# Altium schematic sheet prosthesis.SchDoc
size 558 x 431 mm; SheetNumber: 1; SheetTotal: 1; ENG_APP_DATE: --/--/--; DSN_APP_DATE: --/--/--; CHK_APP_DATE: --/--/--
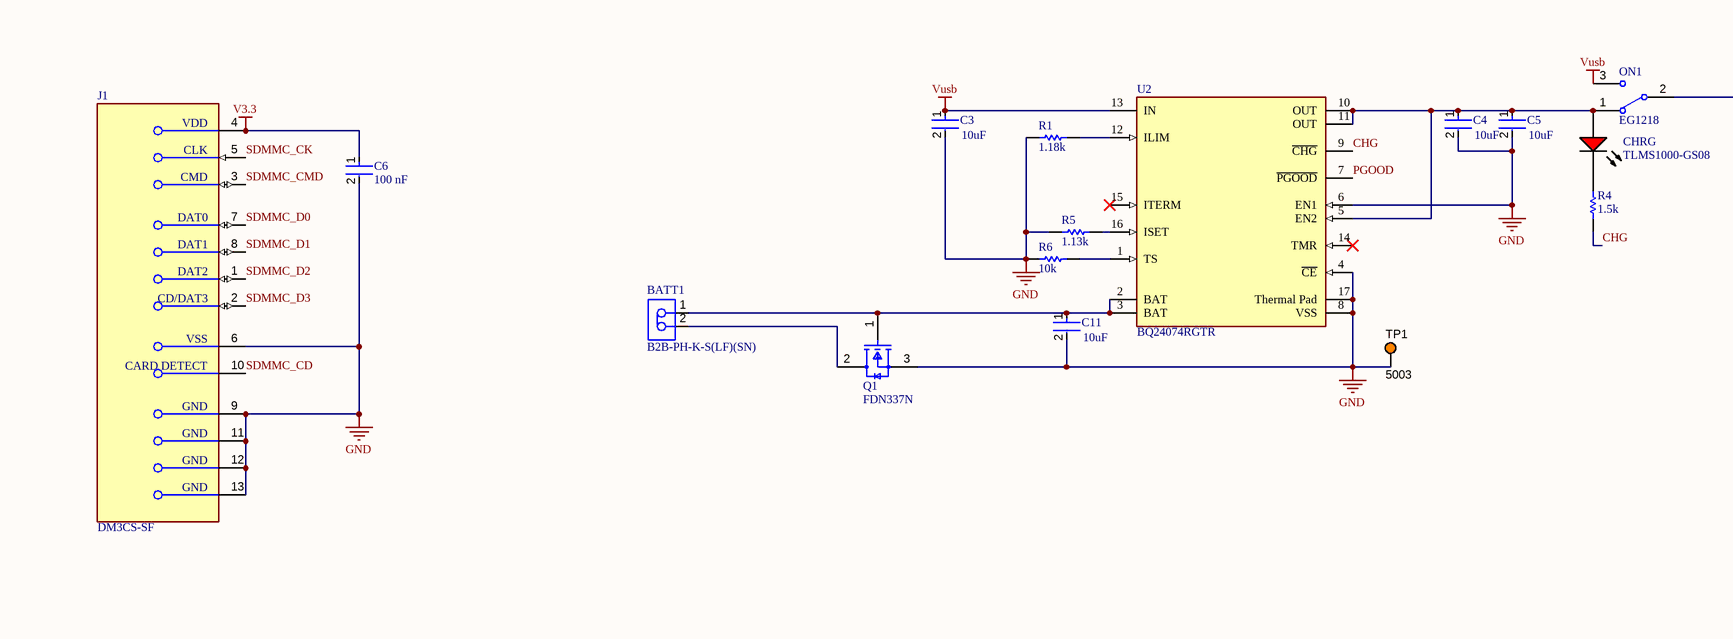
[diagram p0: prosthesis.SchDoc, top left]
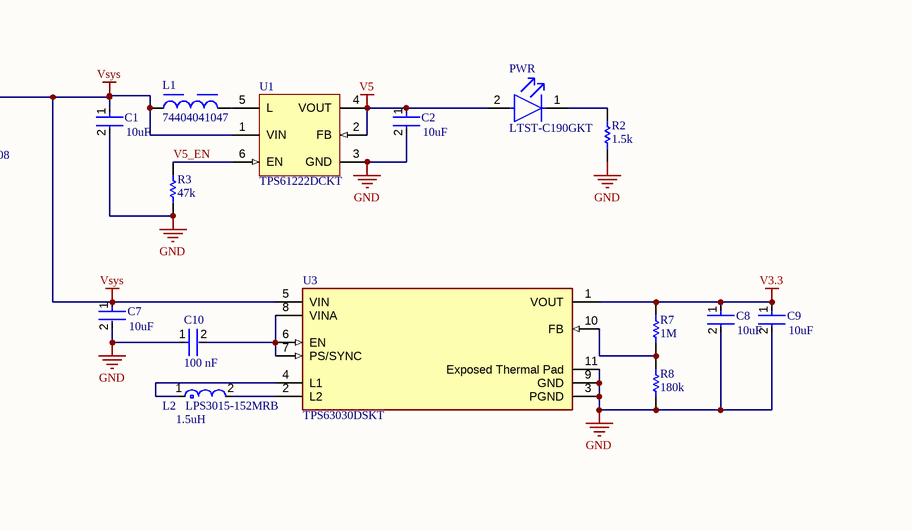
[diagram p1: prosthesis.SchDoc, top right]
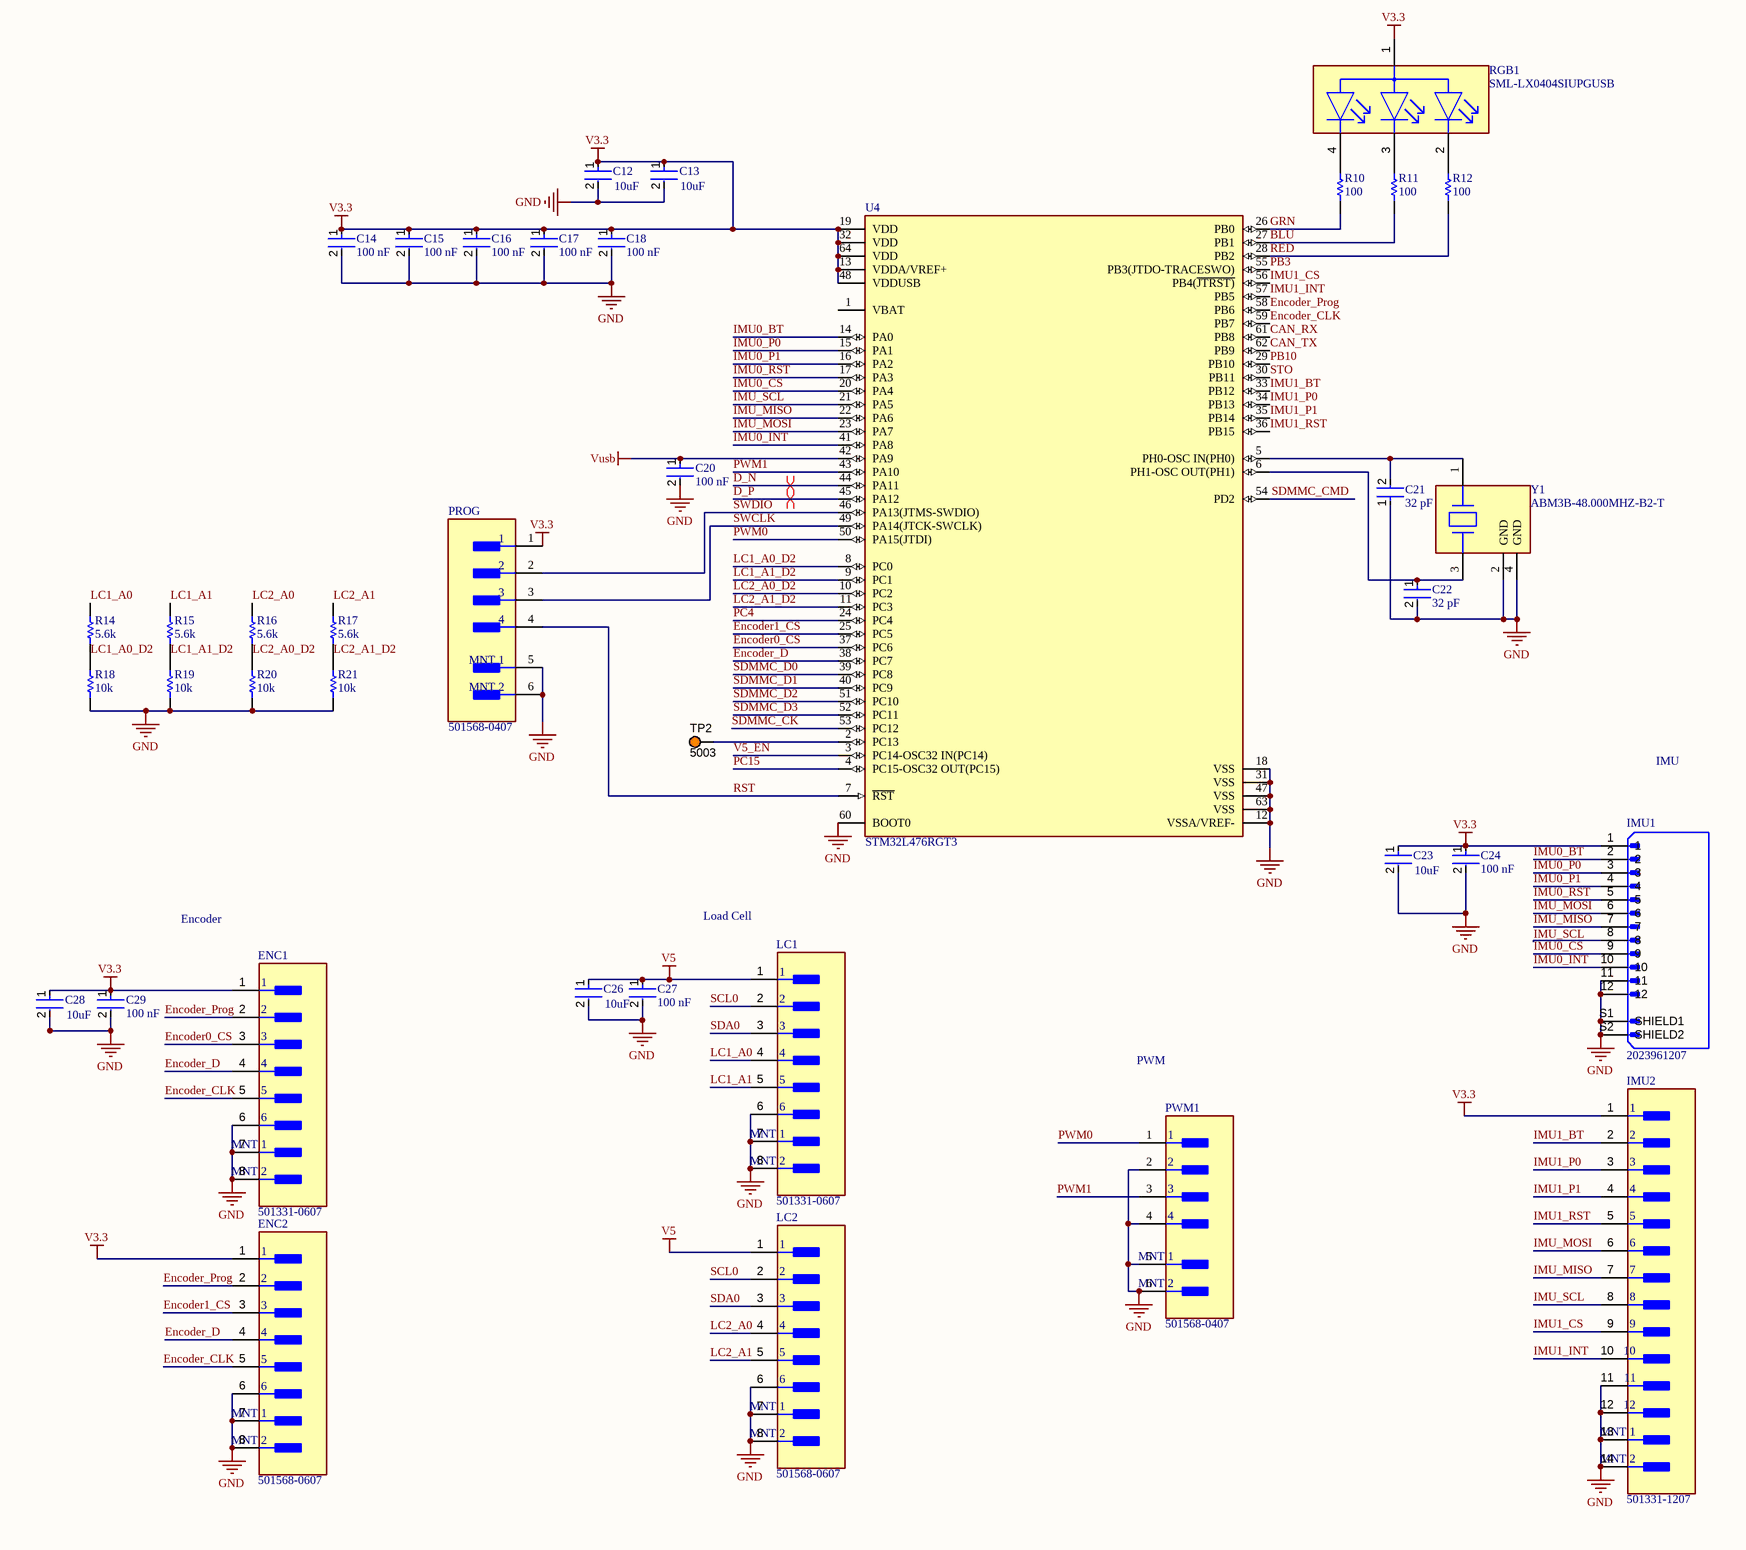
[diagram p2: prosthesis.SchDoc, bottom left]
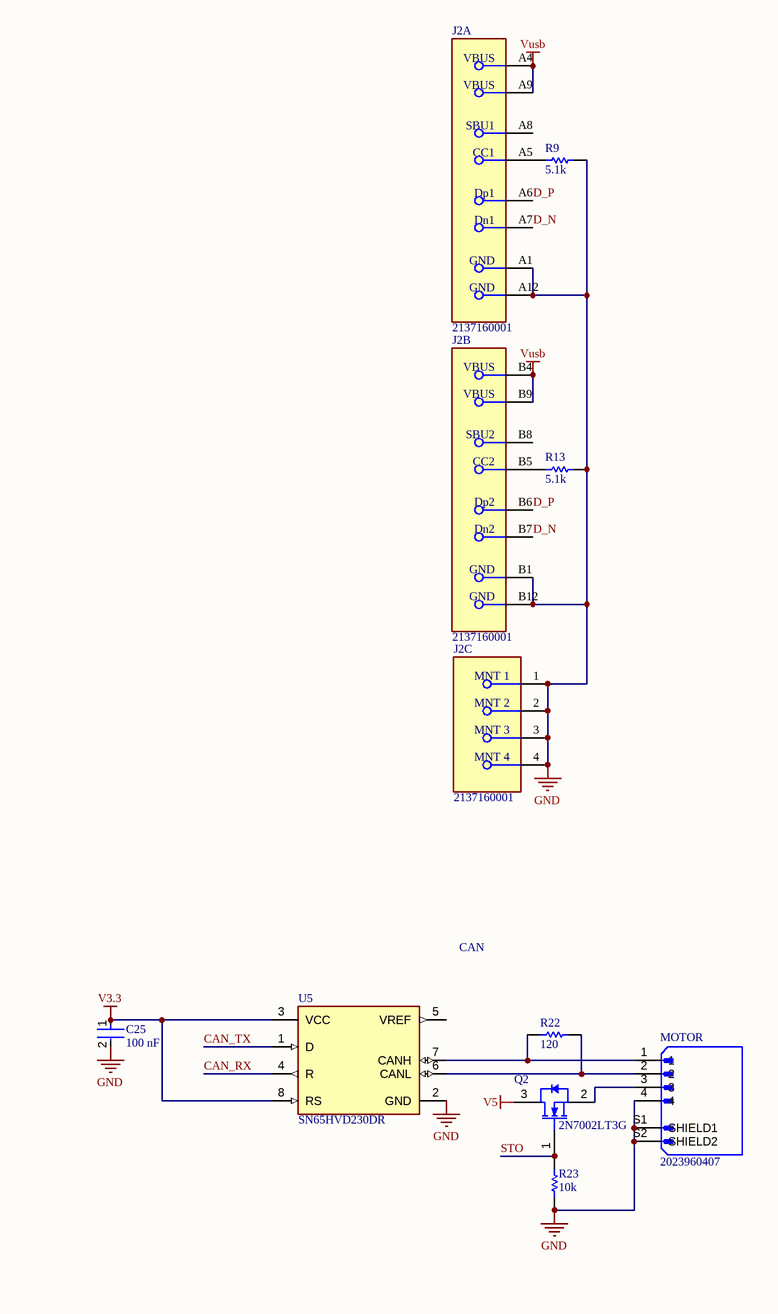
[diagram p3: prosthesis.SchDoc, bottom right]

## Parts
BATT1  B2B-PH-K-S(LF)(SN)  [JST-B2B-PH-K-S_V]
C1  Capacitance: 10uF  [FP-GRM21B-0_1-IPC_C]  (hidden comment: GRM21BR61C106KE15L)
C2  Capacitance: 10uF  [FP-GRM21B-0_1-IPC_C]  (hidden comment: GRM21BR61C106KE15L)
C3  Capacitance: 10uF  [FP-GRM21B-0_1-IPC_C]  (hidden comment: GRM21BR61C106KE15L)
C4  Capacitance: 10uF  [FP-GRM21B-0_1-IPC_C]  (hidden comment: GRM21BR61C106KE15L)
C5  Capacitance: 10uF  [FP-GRM21B-0_1-IPC_C]  (hidden comment: GRM21BR61C106KE15L)
C6  value 100 nF  [FP-CC0805-0_85-MFG]  (hidden comment: CC0805KRX7R7BB104)
C7  Capacitance: 10uF  [FP-GRM21B-0_1-IPC_C]  (hidden comment: GRM21BR61C106KE15L)
C8  Capacitance: 10uF  [FP-GRM21B-0_1-IPC_C]  (hidden comment: GRM21BR61C106KE15L)
C9  Capacitance: 10uF  [FP-GRM21B-0_1-IPC_C]  (hidden comment: GRM21BR61C106KE15L)
C10  value 100 nF  [FP-CC0805-0_85-MFG]  (hidden comment: CC0805KRX7R7BB104)
C11  Capacitance: 10uF  [FP-GRM21B-0_1-IPC_C]  (hidden comment: GRM21BR61C106KE15L)
C12  Capacitance: 10uF  [FP-GRM21B-0_1-IPC_C]  (hidden comment: GRM21BR61C106KE15L)
C13  Capacitance: 10uF  [FP-GRM21B-0_1-IPC_C]  (hidden comment: GRM21BR61C106KE15L)
C14  value 100 nF  [FP-CC0805-0_85-MFG]  (hidden comment: CC0805KRX7R7BB104)
C15  value 100 nF  [FP-CC0805-0_85-MFG]  (hidden comment: CC0805KRX7R7BB104)
C16  value 100 nF  [FP-CC0805-0_85-MFG]  (hidden comment: CC0805KRX7R7BB104)
C17  value 100 nF  [FP-CC0805-0_85-MFG]  (hidden comment: CC0805KRX7R7BB104)
C18  value 100 nF  [FP-CC0805-0_85-MFG]  (hidden comment: CC0805KRX7R7BB104)
C20  value 100 nF  [FP-CC0805-0_85-MFG]  (hidden comment: CC0805KRX7R7BB104)
C21  value 32 pF  [FP-CC0805-0_85-MFG]  (hidden comment: 32pF)
C22  value 32 pF  [FP-CC0805-0_85-MFG]  (hidden comment: 32pF)
C23  Capacitance: 10uF  [FP-GRM21B-0_1-IPC_C]  (hidden comment: GRM21BR61C106KE15L)
C24  value 100 nF  [FP-CC0805-0_85-MFG]  (hidden comment: CC0805KRX7R7BB104)
C25  value 100 nF  [FP-CC0805-0_85-MFG]  (hidden comment: CC0805KRX7R7BB104)
C26  Capacitance: 10uF  [FP-GRM21B-0_1-IPC_C]  (hidden comment: GRM21BR61C106KE15L)
C27  value 100 nF  [FP-CC0805-0_85-MFG]  (hidden comment: CC0805KRX7R7BB104)
C28  Capacitance: 10uF  [FP-GRM21B-0_1-IPC_C]  (hidden comment: GRM21BR61C106KE15L)
C29  value 100 nF  [FP-CC0805-0_85-MFG]  (hidden comment: CC0805KRX7R7BB104)
CHRG  TLMS1000-GS08  [VISH-TLMS1000_V]
ENC1  501331-0607  [FP-501331-0607-MFG]
ENC2  501568-0607  [FP-501568-0607-MFG]
IMU1  2023961207  [MOLEX_2023961207]
IMU2  501331-1207  [FP-501331-1207-MFG]
J1  DM3CS-SF  [FP-DM3CS-SF-MFG]
J2  2137160001  [FP-2137160001-MFG]  (parts A,B,C of 3)
L1  74404041047  [WE-LQS_4012]
L2  LPS3015-152MRB  Inductance: 1.5uH  [FP-LPS3015-MFG]
LC1  501331-0607  [FP-501331-0607-MFG]
LC2  501568-0607  [FP-501568-0607-MFG]
MOTOR  2023960407  [MOLEX_2023960407]
ON1  EG1218  [ESWI-EG1218_V]
PROG  501568-0407  [FP-501568-0407-MFG]
PWM1  501568-0407  [FP-501568-0407-MFG]
PWR  LTST-C190GKT  [FP-LTST-C190GKT-MFG]
Q1  FDN337N  [FP-527AG-MFG]
Q2  2N7002LT3G  [ONSC-SOT-23-3-318-08_V]
R1  1.18k  [RESC2013X70X40ML20T20]
R2  1.5k  [RESC2013X70X40NL20T20]
R3  47k  [RESC2013X70X40ML20T20]
R4  1.5k  [RESC2013X70X40NL20T20]
R5  1.13k  [RESC2013X60X35NL10T20]
R6  10k  [RESC2013X60X35NL10T20]
R7  1M  [RESC1608X55X30NL15T15]
R8  180k  [RESC2013X50X40NL20T20]
R9  5.1k  [RESC2013X60X40LL20T25]
R10  100  [RESC2013X60X40ML20T25]
R11  100  [RESC2013X60X40ML20T25]
R12  100  [RESC2013X60X40ML20T25]
R13  5.1k  [RESC2013X60X40LL20T25]
R14  5.6k  [RESC2013X70X40LL20T20]
R15  5.6k  [RESC2013X70X40LL20T20]
R16  5.6k  [RESC2013X70X40LL20T20]
R17  5.6k  [RESC2013X70X40LL20T20]
R18  10k  [RESC2013X70X40LL20T20]
R19  10k  [RESC2013X70X40LL20T20]
R20  10k  [RESC2013X70X40LL20T20]
R21  10k  [RESC2013X70X40LL20T20]
R22  120  [RESC2013X60X40ML20T25]
R23  10k  [RESC2013X70X40LL20T20]
RGB1  SML-LX0404SIUPGUSB  [FP-SML-LX0404SIUPGUSB-MFG]
TP1  5003  [KSTN-5003]
TP2  5003  [KSTN-5003]
U1  TPS61222DCKT  [DCK0006A_N]
U2  BQ24074RGTR  [FP-RGT0016C-IPC_B]
U3  TPS63030DSKT  [FP-DSK0010A-IPC_B]
U4  STM32L476RGT3  [FP-LQFP64-5W-IPC_C]
U5  SN65HVD230DR  [FP-D0008A-IPC_A]
Y1  ABM3B-48.000MHZ-B2-T  [FP-ABM3B-MFG]

## Nets
GND: C1.2 C2.2 C3.2 C4.2 C5.2 C6.2 C7.2 C8.2 C9.2 C10.1 C11.2 C12.2 C13.2 C14.2 C15.2 C16.2 C17.2 C18.2 C20.2 C21.1 C22.2 C23.2 C24.2 C25.2 C26.2 C27.2 C28.2 C29.2 ENC1.6 ENC1.7(MNT_1) ENC1.8(MNT_2) ENC2.6 ENC2.7(MNT_1) ENC2.8(MNT_2) IMU1.11 IMU1.12 IMU1.S1(SHIELD1) IMU1.S2(SHIELD2) IMU2.11 IMU2.12 IMU2.13(MNT_1) IMU2.14(MNT_2) J1.6(VSS) J1.9(GND) J1.11(GND) J1.12(GND) J1.13(GND) J2.1(MNT_1) J2.2(MNT_2) J2.3(MNT_3) J2.4(MNT_4) J2.A1(GND) J2.A12(GND) J2.B1(GND) J2.B12(GND) LC1.6 LC1.7(MNT_1) LC1.8(MNT_2) LC2.6 LC2.7(MNT_1) LC2.8(MNT_2) MOTOR.4 MOTOR.S1(SHIELD1) MOTOR.S2(SHIELD2) PROG.5(MNT_1) PROG.6(MNT_2) PWM1.2 PWM1.4 PWM1.5(MNT_1) PWM1.6(MNT_2) Q1.3(S) R1.2 R2.1 R3.1 R5.1 R6.1 R8.1 R9.2 R13.2 R18.1 R19.1 R20.1 R21.1 R23.1 TP1.1 U1.3(GND) U2.4(~{CE}) U2.6(EN1) U2.8(VSS) U2.17(Thermal_Pad) U3.3(PGND) U3.9(GND) U3.11(Exposed_Thermal_Pad) U4.12(VSSA/VREF-) U4.18(VSS) U4.31(VSS) U4.47(VSS) U4.60(BOOT0) U4.63(VSS) U5.2(GND) Y1.2(GND) Y1.4(GND)
V3.3: C6.1 C8.1 C9.1 C12.1 C13.1 C14.1 C15.1 C16.1 C17.1 C18.1 C23.1 C24.1 C25.1 C28.1 C29.1 ENC1.1 ENC2.1 IMU1.1 IMU2.1 J1.4(VDD) PROG.1 R7.2 RGB1.1(Common_Anode) U3.1(VOUT) U4.13(VDDA/VREF+) U4.19(VDD) U4.32(VDD) U4.48(VDDUSB) U4.64(VDD) U5.3(VCC) U5.8(RS)
V5: C2.1 C26.1 C27.1 LC1.1 LC2.1 PWR.2(A) Q2.3(D) U1.2(FB) U1.4(VOUT)
Vsys: C1.1 C7.1 L1.1 ON1.2(COM) U1.1(VIN) U3.5(VIN)
Vusb: C3.1 C20.1 J2.A4(VBUS) J2.A9(VBUS) J2.B4(VBUS) J2.B9(VBUS) ON1.3 U2.13(IN) U4.42(PA9)
BLU: R11.1 U4.27(PB1)
CAN_RX: U4.61(PB8) U5.4(R)
CAN_TX: U4.62(PB9) U5.1(D)
CHG: R4.1 U2.9(~{CHG})
D_N: J2.A7(Dn1) J2.B7(Dn2) U4.44(PA11)
D_P: J2.A6(Dp1) J2.B6(Dp2) U4.45(PA12)
Encoder0_CS: ENC1.3 U4.37(PC6)
Encoder1_CS: ENC2.3 U4.25(PC5)
Encoder_CLK: ENC1.5 ENC2.5 U4.59(PB7)
Encoder_D: ENC1.4 ENC2.4 U4.38(PC7)
Encoder_Prog: ENC1.2 ENC2.2 U4.58(PB6)
GRN: R10.1 U4.26(PB0)
IMU0_BT: IMU1.2 U4.14(PA0)
IMU0_CS: IMU1.9 U4.20(PA4)
IMU0_INT: IMU1.10 U4.41(PA8)
IMU0_P0: IMU1.3 U4.15(PA1)
IMU0_P1: IMU1.4 U4.16(PA2)
IMU0_RST: IMU1.5 U4.17(PA3)
IMU1_BT: IMU2.2 U4.33(PB12)
IMU1_CS: IMU2.9 U4.56(PB4(~{JTRST)})
IMU1_INT: IMU2.10 U4.57(PB5)
IMU1_P0: IMU2.3 U4.34(PB13)
IMU1_P1: IMU2.4 U4.35(PB14)
IMU1_RST: IMU2.5 U4.36(PB15)
IMU_MISO: IMU1.7 IMU2.7 U4.22(PA6)
IMU_MOSI: IMU1.6 IMU2.6 U4.23(PA7)
IMU_SCL: IMU1.8 IMU2.8 U4.21(PA5)
LC1_A0: LC1.4 R14.2
LC1_A0_D2: R14.1 R18.2 U4.8(PC0)
LC1_A1: LC1.5 R15.2
LC1_A1_D2: R15.1 R19.2 U4.9(PC1)
LC2_A0: LC2.4 R16.2
LC2_A0_D2: R16.1 R20.2 U4.10(PC2)
LC2_A1: LC2.5 R17.2
LC2_A1_D2: R17.1 R21.2 U4.11(PC3)
PB3: U4.55(PB3(JTDO-TRACESWO))
PB10: U4.29(PB10)
PC4: U4.24(PC4)
PC15: U4.4(PC15-OSC32_OUT(PC15))
PGOOD: U2.7(~{PGOOD})
PWM0: PWM1.1 U4.50(PA15(JTDI))
PWM1: PWM1.3 U4.43(PA10)
RED: R12.1 U4.28(PB2)
RST: PROG.4 U4.7(~{RST})
SCL0: LC1.2 LC2.2
SDA0: LC1.3 LC2.3
SDMMC_CD: J1.10(CARD_DETECT)
SDMMC_CK: J1.5(CLK) U4.53(PC12)
SDMMC_CMD: J1.3(CMD) U4.54(PD2)
SDMMC_D0: J1.7(DAT0) U4.39(PC8)
SDMMC_D1: J1.8(DAT1) U4.40(PC9)
SDMMC_D2: J1.1(DAT2) U4.51(PC10)
SDMMC_D3: J1.2(CD/DAT3) U4.52(PC11)
STO: Q2.1(G) R23.2 U4.30(PB11)
SWCLK: PROG.3 U4.49(PA14(JTCK-SWCLK))
SWDIO: PROG.2 U4.46(PA13(JTMS-SWDIO))
V5_EN: R3.2 U1.6(EN) U4.3(PC14-OSC32_IN(PC14))
NetBATT1_1: BATT1.1 C11.1 Q1.1(G) U2.2(BAT) U2.3(BAT)
NetBATT1_2: BATT1.2 Q1.2(D)
NetC4_1: C4.1 C5.1 CHRG.1(A) ON1.1 U2.5(EN2) U2.10(OUT) U2.11(OUT)
NetC10_2: C10.2 U3.6(EN) U3.7(PS/SYNC) U3.8(VINA)
NetC21_2: C21.2 U4.5(PH0-OSC_IN(PH0)) Y1.1
NetC22_1: C22.1 U4.6(PH1-OSC_OUT(PH1)) Y1.3
NetCHRG_2: CHRG.2(K) R4.2
NetJ2_A5: J2.A5(CC1) R9.1
NetJ2_B5: J2.B5(CC2) R13.1
NetL1_2: L1.2 U1.5(L)
NetL2_1: L2.1 U3.4(L1)
NetL2_2: L2.2 U3.2(L2)
NetMOTOR_1: MOTOR.1 R22.1 U5.7(CANH)
NetMOTOR_2: MOTOR.2 R22.2 U5.6(CANL)
NetMOTOR_3: MOTOR.3 Q2.2(S)
NetPWR_1: PWR.1(C) R2.2
NetR1_1: R1.1 U2.12(ILIM)
NetR5_2: R5.2 U2.16(ISET)
NetR6_2: R6.2 U2.1(TS)
NetR7_1: R7.1 R8.2 U3.10(FB)
NetR10_2: R10.2 RGB1.4(Green_C)
NetR11_2: R11.2 RGB1.3(Blue_C)
NetR12_2: R12.2 RGB1.2(Red_C)
NetTP2_1: TP2.1 U4.2(PC13)

Not connected (* = marked no-connect by the designer): J2 A8(SBU1) B8(SBU2); U2 14(TMR)* 15(ITERM)*; U4 1(VBAT); U5 5(VREF)

## Layout directives
differential pair: D_N, D_P

## Notes on the sheet
- IMU
- CAN
- Encoder
- Load Cell
- PWM
- DWG. NO.
- REV.
- SHT.
- REVISION
- DESCRIPTION
- DATE
- APPROVED
- THIS DOCUMENT AND THE DATA DISCLOSED HEREIN OR HEREWITH IS THE PROPERTY OF ALTIUM LIMITED AND MAY BE FREELY DISTRIBUTED IN WHOLE. NO RIGHTS ARE RESERVED OR EXPRESS OR IMPLIED WARANTEE GIVEN.
- ENG:
- DSN:
- APPROVALS
- PROJECT
- DOCUMENT REVISION:
- DESIGN ITEM:
- CHK:
- BOM:
- REFERENCE DOCUMENTS
- PROJECT REVISION:
- TITLE
- FAB DWG:
- PCB DWG:
- ASSY DWG:
- SCALE:
- SIZE
- C
- CAGE CODE
- FILE NAME
- DWG NO.
- SHEET
- OF
- REV

## Library data of the parts
BATT1 = CMP-2000-05162-1: Male Header, Pitch 2 mm, 1 x 2 Position, Height 6 mm, Tail Length 3.4 mm, -25 to 85 degC, RoHS, Bulk; Manufacturer: JST; Pitch: 2mm; Style/Orientation: StraightHeader/Plug; No of Positions: 2; Datasheet Version: Nov-08; Datasheet URL: http://datasheet.octopart.com/B2B-PH-K-S%28LF%29%28SN%29-JST-datasheet-8324864.pdf; Manufacturer URL: http://www.jst.com/home2.html; Type: ShroudedHeader; Termination: Crimp
C1-C5 C7-C9 C11-C13 C23 C26 C28 = CMP-2007-03453-2: Chip Multilayer Ceramic Capacitors for General Purpose, 0805, 10uF, X5R, 15%, 10%, 16V; Radiation Hardening: No; Thickness: 0.053inch; Voltage Rating (DC): 16V; Lead Free: Lead Free; Package Quantity: 1; Width: 1.25mm; Case Code (Imperial): 0805; Depth: 1.25mm; Packaging: Tape and Reel; Dielectric: X5R; Max Operating Temperature: 85°C; Tolerance: 10%; Voltage Rating: 16V; Voltage: 16V; Height: 1.25mm; Case Code (Metric): 2012; Material: Ceramic; Mount: Surface Mount; Case/Package: 0805; REACH SVHC: No SVHC; Length: 2mm; Min Operating Temperature: -55°C; Termination: SMD/SMT
C6 C10 C14-C18 C20 C24 C25 C27 C29 = CMP-1036-04402-6: CAP CER 0.1UF 16V X7R 0805; Manufacturer: Yageo; Material: Ceramic; Tolerance: 0.1; Manufacturer Part Number: CC0805KRX7R7BB104; Temperature: -30°C to +85°C; Lead Free: Yes; Footprint Url: http://www.yageo.com/exep/pages/download/literatures/UPY-C_GEN_24.pdf; Voltage Rating: 16 V; Package: CC0805-0.85; RoHS: TRUE; Digikey Description: CAP CER 0.1UF 16V X7R 0805; Category: Cap; Octopart: https://octopart.com/cc0805krx7r7bb104-yageo-39467769; Capacitance: 100 nF; Device Class L3: Ceramic Capacitors; ComponentLink2URL: http://www.yageo.com/documents/recent/UPY-GPHC_Y5V_6.3V-to-50V_8.pdf; Temperature Range Low: -30°C; Mouser Description: Multilayer Ceramic Capacitors MLCC - SMD/SMT 100nF 16V X7R 10%; Automotive: No; Device Class L2: Capacitors; Height: 0.95mm; ComponentLink2Description: Datasheet; Temperature Characteristic: X7R; Ipc Land Pattern Name: CAPC200125X85; Device Class L1: Passive Components; Temperature Range High: +85°C
C21 C22 = CMP-1036-04402-6: CAP CER 32pF 16V X7R 0805; Manufacturer Part Number: CC0805KRX7R7BB104; Manufacturer: Yageo; Material: Ceramic; Tolerance: 0.1; Capacitance: 100 nF; Temperature: -30°C to +85°C; Lead Free: Yes; Footprint Url: http://www.yageo.com/exep/pages/download/literatures/UPY-C_GEN_24.pdf; Voltage Rating: 16 V; Package: CC0805-0.85; RoHS: TRUE; Digikey Description: CAP CER 0.1UF 16V X7R 0805; Category: Cap; Octopart: https://octopart.com/cc0805krx7r7bb104-yageo-39467769; Device Class L3: Ceramic Capacitors; ComponentLink2URL: http://www.yageo.com/documents/recent/UPY-GPHC_Y5V_6.3V-to-50V_8.pdf; Temperature Range Low: -30°C; Mouser Description: Multilayer Ceramic Capacitors MLCC - SMD/SMT 100nF 16V X7R 10%; Automotive: No; Device Class L2: Capacitors; Height: 0.95mm; ComponentLink2Description: Datasheet; Temperature Characteristic: X7R; Ipc Land Pattern Name: CAPC200125X85; Device Class L1: Passive Components; Temperature Range High: +85°C
CHRG = CMP-2000-07254-1: Low Current LED, 40 mW, 1.8 V, -40 to 100 degC, 2-Pin SMD (0603), RoHS, Tape and Reel; Manufacturer: Vishay; Lens Shape: Rectangular; Automotive Qualification Standard: AEC-Q100; Wavelength Typ: 636nm; SVHC: ToBeAdvised; LED Colour: Red; Bulb Size: 1.6mmx0.8mm; Forward Voltage: 1.8V; Luminous Intensity: 4mcd; Forward Current If: 2mA; Viewing Angle: 80°; Datasheet Version: Rev. 1.7, 02/2011; Datasheet URL: https://datasheet.ciiva.com/5798/1698881-5798337.pdf; LED Mounting: SMD; Packaging: CutTape; Package Reference: TLMS1000; Manufacturer URL: http://www.vishay.com/; Mounting Technology: SurfaceMount; Product Range: -; Package Description: 2-Pin Surface Mount Device, Body 1.6 x 0.8 mm; MSL: MSL2-1year
ENC1 LC1 = CMP-04776-000269-1: CONN HEADER SMD 6POS 1MM; Number of Positions: 6; Glow Wire Compliant: Non-compliant; Current Rating: 1A; Voltage Rating (AC): 50V; Gender: Male; Contact Resistance: 20mR; Connector Type: Male Pin; Max Voltage Rating (DC): 5.05kV; Color: Natural; Radiation Hardening: No; Housing Color: Natural; Max Operating Temperature: 85°C; Fastening Type: Detent; Min Operating Temperature: -40°C; Series: 501331; Orientation: Vertical; Number of Contacts: 6; Number of Circuits: 6; Contact Material: Bronze; Contact Gender: Male; Contact Plating: Tin; Lead Free: Lead Free; Number of Rows: 1; Max Voltage Rating (AC): 50V; Depth: 5.07mm; Pitch: 1mm; Packaging: Tape and Reel; Termination: Solder; RoHS Compliant: Yes; Mount: Surface Mount; Housing Material: Nylon; Voltage Rating: 50V; Contact Type: Male Pin; Package Quantity: 1100
ENC2 LC2 = CMP-04776-000027-1: CONN HEADER SMD R/A 6POS 1MM; Manufacturer: Molex; Conn Orientation: Right Angle; Conn Gender: Male; Current Rating: 1A; Number Of Contacts: 6; Voltage Rating: 50V; Standoff Height: 0.1mm; ComponentLink2Description: Datasheet; Device Class L3: unset; Temperature Range High: +105°C; Temperature Range Low: -40°C; Automotive: No; Mouser Description: Headers & Wire Housings 1.0 WtB 6Ckt R/AWaferAssyEmbsTpPk; Pitch: 1mm; Digikey Description: CONN HEADER SMD R/A 6POS 1MM; Height: 4.9mm; Category: Conn; Temperature: -40°C to +105°C; Footprint Url: https://www.molex.com/pdm_docs/sd/5015680607_sd.pdf; RoHS: TRUE; Number Of Rows: 1; Device Class L1: Connectors; Ambient Temperature Range High: +105°C; Lead Free: Yes; Device Class L2: Headers and Wire Housings; Manufacturer Part Number: 501568-0607; Octopart: https://octopart.com/501568-0607-molex-1389391; Package: 501568-0607; Ambient Temperature Range Low: -40°C; Contact Material: Tin,Nickel; ComponentLink2URL: https://www.molex.com/webdocs/datasheets/pdf/en-us/5015680607_PCB_HEADERS.pdf
IMU2 = CMP-04776-000917-1: CONN HEADER SMD 12POS 1MM; Number of Contacts: 12; Contact Resistance: 20mR; Current Rating: 1A; Voltage Rating: 50V; Glow Wire Compliant: Non-compliant; Max Voltage Rating (DC): 5.05kV; Gender: Male; Contact Plating: Tin; Housing Color: Natural; Connector Type: Header; Max Operating Temperature: 85°C; Number of Rows: 1; Color: Natural; Housing Material: Nylon; Depth: 5mm; Orientation: Vertical; Package Quantity: 1100; Contact Material: Bronze; Mount: Surface Mount; Contact Type: Male Pin; Flammability Rating: UL94 V-0; Max Voltage Rating (AC): 50V; RoHS Compliant: Yes; Series: 501331; Contact Shape: Square; Length: 14.24mm; Fastening Type: Latch; Termination: Solder; Pitch: 1mm; Voltage Rating (DC): 50V; Min Operating Temperature: -40°C; Contact Finish - Mating: TIN; Radiation Hardening: No; Insulation Color: Natural; Insulation Material: Nylon; Lead Free: Lead Free; Number of Positions: 12; Number of Circuits: 12; Packaging: Tape and Reel
J1 = CMP-11597-000003-1: CONN MICRO SD CARD HINGED TYPE; Pitch: 1.1mm; Connector Type: Connector; Current Rating: 500mA; Voltage Rating (AC): 125V; Gender: Female; Insulation Resistance: 1GR; Number of Positions: 8; Contact Resistance: 100mR; Packaging: Tape and Reel; Flammability Rating: UL94 V-0; Lead Free: Lead Free; Min Operating Temperature: -25°C; Orientation: Right Angle; Width: 13.8mm; Number of Rows: 1; Housing Material: Polymer; Package Quantity: 1; Mount: Surface Mount; Max Current Rating: 500mA; Radiation Hardening: No; Max Operating Temperature: 85°C; Contact Plating: Gold; Depth: 1.83mm; Contact Material: Gold; Length: 14.1mm; Number of Contacts: 8; Termination: Solder
J2 = CMP-00257-115676458-1: 2137160001 Conn USB 2.0 Type C F 16 POS 0.85mm Solder RA Thru-Hole 16 Terminal 1 Port T/R; Number of Contacts: 16; Voltage Rating: 30V; USB Standard: USB 2.0; Height: 3.46mm; NexarPartId: 115676458; Min Operating Temperature: -30°C; Max Operating Temperature: 85°C; Schedule B: 8536695050; Contact Material: Gold, Nickel
L1 = CMP-03913-61645198-1: 74404041047 Inductors, Fixed, WE-LQS SMD 4012 4.7uH 1.55A 91mOhms; Test Frequency: 100kHz; Inductance Tolerance: 20%; Shielding: Shielded; DC Resistance (DCR): 91mΩ; Self Resonant Frequency: 55MHz; Inductance: 4.7µH; Saturation Current: 1.9A; Packaging: Tape & Reel (TR); Composition: Wirewound; Tolerance: 20%; Ambient Temperature Range Low: -40°C; Length: 4mm; Case/Package: Nonstandard; Height: 1.2mm; Min Operating Temperature: -40°C; Ambient Temperature Range High: 85°C; Width: 4mm; Current Rating: 1.55A; Max Operating Temperature: 125°C; Height - Seated (Max): 1.1938mm; Mount: Surface Mount; NexarPartId: 61645198; RoHS: Compliant
L2 = CMP-2000-06574-2: Fixed Inductors LPS3015 AEC-Q200 1.5uH 1.4A 20% SMD; Max DC Current: 2.1A; RMS Current (Irms): 1.1A; DC Resistance (DCR): 110mR; Core Material: Ferrite; Saturation Current: 2A; Shielding: Shielded; Test Frequency: 100kHz; Self Resonant Frequency: 110MHz; REACH SVHC: No SVHC; Weight: 0.001411oz; Height: 1.4mm; Max Operating Temperature: 85°C; Termination: SMD/SMT; Inductance Tolerance: 20%; Packaging: Cut Tape; Min Operating Temperature: -40°C; Width: 3mm; Package Quantity: 1; Tolerance: 20%; Length: 3mm
ON1 = CMP-1696-00002-1: Slide Switch, 500 V, -20 to 70 degC, 3-Pin THD, RoHS; Case\Package: SOT-23-5; Output Current: 150 mA; Nominal Output Voltage: 3.3 V; Max Power Dissipation: 250 mW; Min Input Voltage: 4.3 V; Outputs: 1; Max Input Voltage: 8 V; Dropout Voltage: 300 mV; PackageDescription: 3-Pin Through Hole Device, Body 11.6 x 4 mm, Pitch 2.5 mm; ComponentLink1URL: http://www.e-switch.ch/en/; RoHSCompliant: true; Length: 3 mm; ComponentLink1Description: Manufacturer URL; Power Rating: 250 mW; Mount: Surface Mount; Max Operating Temperature: 85 degC; REACH SVHC: No SVHC; Radiation Hardening: No; Height: 1.3 mm; Pins: 5; Max Ouput Current: 150 mA; Output Voltage: 3.3 V; Width: 1.8 mm; Package Quantity: 3000; ComponentLink2URL: https://www.e-switch.com/system/asset/product_line/data_sheet/119/EG.pdf; Min Operating Temperature: -40 degC; ComponentLink2Description: Datasheet; DatasheetVersion: Oct-15; PackageReference: EG1218; Packaging: Tape and Reel
PROG PWM1 = CMP-04776-000298-1: CONN HEADER SMD R/A 4POS 1MM; Voltage Rating: 50V; Number of Circuits: 4; Max Voltage Rating (DC): 5.05kV; Current Rating: 1A; Connector Type: Male Pin; Glow Wire Compliant: Non-compliant; Gender: Male; Orientation: Right Angle; Contact Type: Male Pin; Pitch: 1mm; Package Quantity: 1700; Depth: 5.35mm; Housing Material: Nylon; Series: Pico-Clasp; Contact Plating: Tin; Fastening Type: Detent; Color: Natural; Packaging: Tape and Reel; Contact Material: Bronze; Voltage Rating (AC): 50V; Length: 6mm; Termination: Solder; RoHS Compliant: Yes; Radiation Hardening: No; Max Voltage Rating (AC): 50V; Mount: Surface Mount; Max Operating Temperature: 85°C; Number of Positions: 4; Number of Contacts: 4; Lead Free: Lead Free; Number of Rows: 1; Min Operating Temperature: -40°C; Housing Color: Natural
PWR = CMP-22017-000005-2: LED GREEN CLEAR CHIP SMD; Dominant Wavelength: 569nm; Reverse Voltage: 5V; Lens Color: Colorless; Viewing Angle: 130°; Voltage: 2V; Forward Current: 30mA; Power Dissipation: 100mW; Luminous Intensity: 6mcd; Number of LEDs: 1; Forward Voltage: 2.1V; Wavelength: 565nm; Test Current: 10mA; Min Operating Temperature: -55°C; Lens Style: Clear; Mount: Surface Mount; Width: 0.8mm; Packaging: Tape and Reel; Lens Transparency: Clear; Case Code (Metric): 1608; Depth: 0.8mm; Case Code (Imperial): 0603; Case/Package: 0603; Number of Pins: 2; Max Operating Temperature: 85°C; Lead Free: Lead Free; Number of Elements: 1; Length: 1.6mm; Height: 0.8mm; Package Quantity: 1; Power Rating: 100mW; Radiation Hardening: No; Illumination Color: Green; Color: Green
Q1 = CMP-2000-06250-2: MOSFET N-CH 30V 2.2A SSOT3; Drain-source On Resistance-Max: 65mR; Threshold Voltage: 700mV; Element Configuration: Single; Fall Time: 4ns; Input Capacitance: 300pF; Polarity: N-CHANNEL; Rise Time: 10ns; Power Dissipation: 500mW; Gate to Source Voltage (Vgs): 8V; Turn-Off Delay Time: 17ns; Number of Elements: 1; Length: 2.92mm; Current Rating: 2.2A; Continuous Drain Current (ID): 2.2A; Weight: 0.03g; Packaging: Tape and Reel; Rds On Max: 65mR; Contact Plating: Tin; Drain to Source Breakdown Voltage: 30V; Min Operating Temperature: -55°C; Height: 0.94mm; Case/Package: TO-236-3; Series: -; On-State Resistance: 65mR; Termination: SMD/SMT; Lead Free: Lead Free; Mount: Surface Mount; Package Quantity: 1; Number of Pins: 3; Drain to Source Resistance: 65mR; Voltage Rating (DC): 30V; REACH SVHC: No SVHC; Max Operating Temperature: 150°C; Drain to Source Voltage (Vdss): 30V; RoHS Compliant: Yes; Nominal Vgs: 700mV; Turn-On Delay Time: 4ns; Dual Supply Voltage: 30V; Width: 3.05mm; Max Power Dissipation: 500mW
Q2 = CMP-1058-00782-1: Small Signal MOSFET, 60 V, 115 mA, N-Channel, 3-Pin SOT-23, Pb-Free, Tape and Reel; Manufacturer: On Semiconductor; Configuration: Single; VGS Max (V): 20; V(BR)DSS Min (V): 60; ID Max (A): 0.115; VGS(th) Max (V): 2.5; Channel Polarity: N Channel; PackageVersion: Rev. AP, 11/2009; RoHS: Pb-Free; ComponentLink1URL: http://www.onsemi.com/; ComponentLink3Description: Package Specification; ComponentLink3URL: http://www.onsemi.cn/pub_link/Collateral/318-08.PDF; DatasheetVersion: Rev. 7; Packing: Tape and Reel; ComponentLink1Description: Manufacturer URL; Mounting Technology: Surface Mount; ComponentLink2URL: http://www.onsemi.com/pub_link/Collateral/2N7002L-D.PDF; PartNumber: 2N7002LT3G; ComponentLink2Description: Datasheet; PackageDescription: 3-Pin Small Outline Transistor, Body 2.92 x 1.3 mm, Pitch 0.95 mm; Package Type: SOT-23-3; PackageReference: SOT-23-3-318-08
R1 = CMP-2001-00510-1: Manufacturer: Panasonic; Part Number: ERJ-6ENF1181V
R2 R4 = CMP-1013-00078-2: Manufacturer: Panasonic; Part Number: ERJ-6GEYJ152V
R3 = CMP-2001-00421-1: Manufacturer: Panasonic; Part Number: ERJ-6GEYJ473V
R5 = CMP-2001-00957-1: Manufacturer: Yageo; Part Number: RC0805FR-071K13L
R6 = CMP-1659-00013-4: Chip Resistor, 10 KOhm, +/- 1%, 0.125 W, -55 to 155 degC, 0805 (2012 Metric), RoHS, Tape and Reel; Manufacturer: Yageo; Voltage Rating: 150 V; Mount: Surface Mount; ComponentLink1Description: Manufacturer URL; ComponentLink2URL: http://www.yageo.com/documents/recent/PYu-RC_Group_51_RoHS_L_04.pdf; Pins: 2; Length: 2 mm; Min Operating Temperature: -55 degC; Height: 0.5 mm; Mounting Technology: Surface Mount; RoHSCompliant: true; REACH SVHC: No SVHC; ComponentLink1URL: http://www.yageo.com/; Max Operating Temperature: 155 degC; PackageReference: 0805; DatasheetVersion: Rev. 4, 02/2016; Package Quantity: 5000; Packaging: Tape and Reel; ComponentLink2Description: Datasheet; PackageDescription: 2-Pin Surface Mounted Device, Body 2 x 1.25 mm
R7 = CMP-2000-00706-1: Part Number: ERJ-3GEYJ105V; Manufacturer: Panasonic
R8 = CMP-2001-04827-1: Part Number: RG2012N-184-W-T1; Manufacturer: Susumu
R9 R13 = CMP-2001-00713-1: Manufacturer: Panasonic; Part Number: ERA-6YEB512V
R10-R12 = CMP-2001-00580-1: Manufacturer: Panasonic; Part Number: ERA6AEB101V
R14-R21 R23 = CMP-2001-00558-1: Part Number: ERJ6ENF5601V; Manufacturer: Panasonic
R22 = CMP-2001-00588-1: Manufacturer: Panasonic; Part Number: ERA6AEB121V
RGB1 = CMP-2000-07119-2: LED RGB CLEAR SMD; Test Current: 2mA; Wavelength: 465nm; Lens Style: Square; Power Rating: 30mW; Lens Color: Colorless; Number of LEDs: 3; Viewing Angle: 120°; Luminous Intensity: 20mcd; Forward Voltage: 2.73V; Height: 0.3mm; Lead Free: Lead Free; Max Operating Temperature: 85°C; Mount: Surface Mount; REACH SVHC: No SVHC; Case Code (Imperial): 0404; Forward Current: 2mA; Case Code (Metric): 1010; Lens Transparency: Clear; Color: Blue; Length: 1mm; Packaging: Tape and Reel; Min Operating Temperature: -40°C; Package Quantity: 2000; Case/Package: 0404; Width: 1mm
TP1 TP2 = CMP-1672-00009-1: Test Point, Orange, 1-Pin THD, RoHS; Peak Reverse Current: 600 uA; Forward Current: 3 A; Max Surge Current: 80 A; Forward Voltage: 1.08 V; Max Operating Temperature: 150 degC; PackageReference: 5003; Pins: 2; ComponentLink2URL: http://keyelco.com/userAssets/file/M65p56.pdf; PackageDescription: 1-Pin Through Hole Device, Dia 2.54 mm; Weight: 0.01 lb; Diameter: 5.3 mm; Mount: Through Hole; Package Quantity: 500; Packaging: Bulk; Min Operating Temperature: -65 degC; ComponentLink1Description: Manufacturer URL; Height: 0.25 inch; ComponentLink1URL: http://www.keyelco.com/; ComponentLink2Description: Datasheet; Width: 0.25 inch; REACH SVHC: No SVHC; RoHSCompliant: true; Radiation Hardening: No; Length: 9.5 mm; DatasheetVersion: Jun-15
U1 = CMP-0343-00079-2: Boost Voltage Converter with 0.7 to 5.5 V Input and 5 V Output, -40 to 85 degC, 6-Pin SC70 (DCK), Green (RoHS & no Sb/Br); Manufacturer: Texas Instruments; Vin(Min)(V): 0.7; Vout(Max)(V): 5; SubFamily: Step-Up Regulator; Regulated Outputs(#): 1; Vin(Max)(V): 5.5; Switching Frequency(Max)(kHz): 2000; Eco-Plan: Green (RoHS & no Sb/Br); ComponentLink1URL: http://www.ti.com/general/docs/lit/getliterature.tsp?genericPartNumber=TPS61222&fileType=pdf; Topology: Boost; Code_JEDEC: MO-203-AB; DatasheetVersion: SLVS776; ComponentLink2Description: Package Specification; ComponentLink1Description: Datasheet; PackageVersion: revG, Jan-2007; PackageDescription: 6-Pin Plastic Small-Outline Package, 2 x 1.3 mm Body, 0.65 mm Pitch, 2.1 mm Lead Span; Vout(Min)(V): 5; ComponentLink2URL: http://www.ti.com/litv/pdf/mpds114c; PackageReference: DCK0006A; Mounting Technology: Surface Mount; PartNumber: TPS61222DCKT
U2 = CMP-0321-00220-3: IC LI-ION CHARGE MGMT 16-QFN; Fault Protection: Over Voltage; Max Charge Current: 1.5A; Interface: USB; Max Supply Voltage: 10.2V; Number of Cells: 1; Battery Pack Voltage: 4.2V; Min Supply Voltage: 4.35V; Battery Chemistry: LITHIUM-ION; Min Input Voltage: 4.3V; Lead Free: Lead Free; Max Operating Temperature: 125°C; RoHS Compliant: Yes; Contact Plating: Gold; Min Operating Temperature: -40°C; Weight: 0.000808oz; Package Quantity: 3000; Radiation Hardening: No; Case/Package: VQFN; Output Voltage: 4.2V; Packaging: Tape and Reel; Series: -; Output Current: 1.5A; Number of Pins: 16
U3 = CMP-0349-00012-4: IC REG BCK BST ADJ 900MA 10SON; Output Current: 800mA; Operating Supply Voltage: 5.5V; Min Input Voltage: 1.8V; Switching Frequency: 2.4MHz; Output Type: Adjustable; Quiescent Current: 25uA; Min Output Voltage: 1.2V; Topology: Buck-Boost; Number of Outputs: 1; Efficiency: 96%; Synchronous Rectifier: Yes; Lead Free: Lead Free; Max Operating Temperature: 85°C; Number of Pins: 10; Termination: SMD/SMT; Min Operating Temperature: -40°C; Width: 2.5mm; Frequency: 2.4MHz; Min Supply Voltage: 1.8V; Package Quantity: 1; Radiation Hardening: No; Max Output Voltage: 5.5V; Max Input Voltage: 5.5V; Packaging: Tape and Reel; Max Output Current: 800mA; Length: 2.5mm; Output Voltage: 5.5V; REACH SVHC: No SVHC; Height: 0.75mm
U4 = CMP-12105-000133-1: IC MCU 32BIT 1MB FLASH 64LQFP; Core Architecture: ARM; Frequency: 80MHz; Number of I/Os: 51; Peripherals: Brown-out Detect/Reset; Interface: I2C; Oscillator Type: Internal; Case/Package: LQFP; Memory Type: FLASH; Packaging: Tray; Min Operating Temperature: -40°C; Memory Size: 1MB; Max Operating Temperature: 125°C
U5 = CMP-0315-00015-3: IC TRANSCEIVER HALF 1/1 8SOIC; Number of Transceivers: 1; Operating Supply Voltage: 3.3V; Number of I/Os: 2; Max Supply Current: 17mA; Max Supply Voltage: 3.6V; Min Supply Voltage: 3V; Data Rate: 1Mbps; Min Operating Temperature: -40°C; Packaging: Tape and Reel; Lead Free: Lead Free; Number of Transmit Buffers: 1; Max Operating Temperature: 85°C; Number of Receive Buffers: 1; Number of Pins: 8; Package Quantity: 1; Radiation Hardening: No; Case/Package: D; REACH SVHC: No SVHC; Weight: 0.002561oz; Termination: SMD/SMT; Contact Plating: Gold; Nominal Supply Current: 17mA; Number of Receivers: 1; Number of Drivers: 1
Y1 = CMP-27762-010589-1: Crystal 48MHz ±20ppm 18pF SMD-4 5mm x 3.2mm; Frequency Stability: 50ppm; Series Resistance: 50R; Package Quantity: 1000; Packaging: Tape and Reel; Frequency Tolerance: 20ppm; Depth: 3.2mm; Max Operating Temperature: 70°C; Lead Free: Lead Free; ESR (Equivalent Series Resistance): 50R; Operating Frequency: 48 MHz; REACH SVHC: No SVHC; Frequency: 48MHz; Length: 5mm; Min Operating Temperature: -20°C; Tolerance: 20ppm; Load Capacitance: 18pF; Case/Package: SMD/SMT; Series: ABM3B; Number of Pins: 4; Termination: SMD/SMT; Height: 0.043inch; Resistor Type: Ceramic; Mount: Surface Mount; Width: 3.2mm
IMU1 = 2023961207: Price: None; MP: 2023961207; Value: *; Availability: Unavailable; Package: None
MOTOR = 2023960407: Package: None; Value: *; MP: 2023960407; Availability: Unavailable; Price: None